# Altium schematic sheet ŞEMATİK.SchDoc
size A4
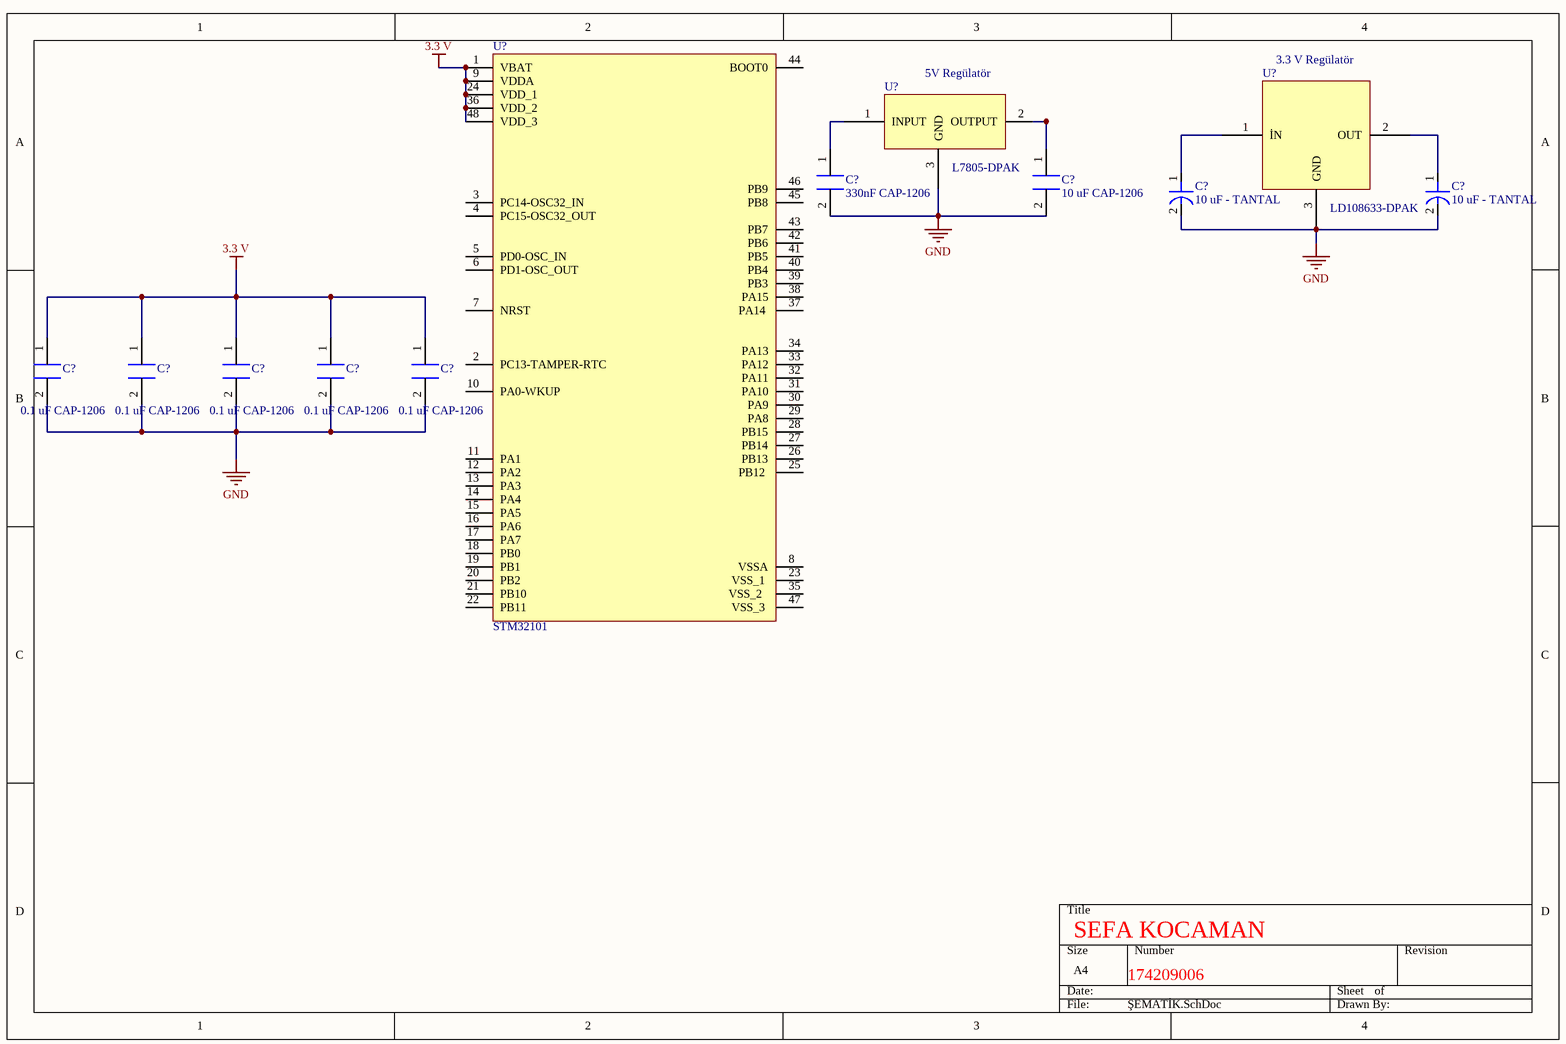
[diagram p0: ŞEMATİK.SchDoc]

## Parts
(Parts that share a designator on the sheet are numbered #1, #2 ... from top to bottom, then left to right.)
C?#1  330nF CAP-1206  [CAP-1206]
C?#2  10 uF CAP-1206  [CAP-1206]
C?#3  10 uF - TANTAL  [CAP-1206 TANTAL]
C?#4  10 uF - TANTAL  [CAP-1206 TANTAL]
C?#5  0.1 uF CAP-1206  [CAP-1206]
C?#6  0.1 uF CAP-1206  [CAP-1206]
C?#7  0.1 uF CAP-1206  [CAP-1206]
C?#8  0.1 uF CAP-1206  [CAP-1206]
C?#9  0.1 uF CAP-1206  [CAP-1206]
U?#1  L7805-DPAK  [DPAKL7805 REGULATOR]
U?#2  LD108633-DPAK  [DPAKL7805 REGULATOR]
U?#3  STM32101  [FQP48]

## Nets
3.3 V: C?#5.1 C?#6.1 C?#7.1 C?#8.1 C?#9.1 U?#3.1(VBAT) U?#3.9(VDDA) U?#3.24(VDD_1) U?#3.36(VDD_2) U?#3.48(VDD_3)
GND: C?#1.2 C?#2.2 C?#3.2 C?#4.2 C?#5.2 C?#6.2 C?#7.2 C?#8.2 C?#9.2 U?#1.3(GND) U?#2.3(GND)
NetC?#1_1: C?#1.1 U?#1.1(INPUT)
NetC?#2_1: C?#2.1 U?#1.2(OUTPUT)
NetC?#3_1: C?#3.1 U?#2.1(İN)
NetC?#4_1: C?#4.1 U?#2.2(OUT)

Not connected (* = marked no-connect by the designer): U?#3 2(PC13-TAMPER-RTC) 3(PC14-OSC32_IN) 4(PC15-OSC32_OUT) 5(PD0-OSC_IN) 6(PD1-OSC_OUT) 7(NRST) 8(VSSA) 10(PA0-WKUP) 11(PA1) 12(PA2) 13(PA3) 14(PA4) 15(PA5) 16(PA6) 17(PA7) 18(PB0) 19(PB1) 20(PB2) 21(PB10) 22(PB11) 23(VSS_1_) 25(PB12_) 26(PB13) 27(PB14) 28(PB15) 29(PA8) 30(PA9) 31(PA10) 32(PA11) 33(PA12) 34(PA13) 35(VSS_2__) 37(PA14_) 38(PA15) 39(PB3) 40(PB4) 41(PB5) 42(PB6) 43(PB7) 44(BOOT0) 45(PB8) 46(PB9) 47(VSS_3_)

## Notes on the sheet
- (near U?#1) 5V Regülatör
- 3.3 V Regülatör
- SEFA KOCAMAN
- 174209006

## Library data of the parts
C?#1 = 330nF CAP-1206: 330nF 1206
C?#3 C?#4 = 10 uF - TANTAL: KUTUPLU
C?#5-C?#9 = 0.1 uF CAP-1206: 0.1 uF 1206
U?#1 = L7805-DPAK: 5V REGÜLATÖR DPAK
U?#2 = LD108633-DPAK: 3.3V  REGÜLATÖR
U?#3 = STM32101: STM32F48 101 İŞLEMCİ; ComponentLink1Description: New link; ComponentLink1URL: *; ComponentLink2Description: New link; ComponentLink2URL: *; ComponentLink3Description: New link; ComponentLink3URL: *